# EasyEDA Pro project ProProject_GD32小车_2024-05-09.epro

# Schematic Schematic1
Create Date: 2024-04-27; Page Name: P1; Project Name: GD32小车; Schematic Name: Schematic1; Update Date: 2024-04-30; Company: 嘉立创EDA; Page Size: A4; Version: V1.0
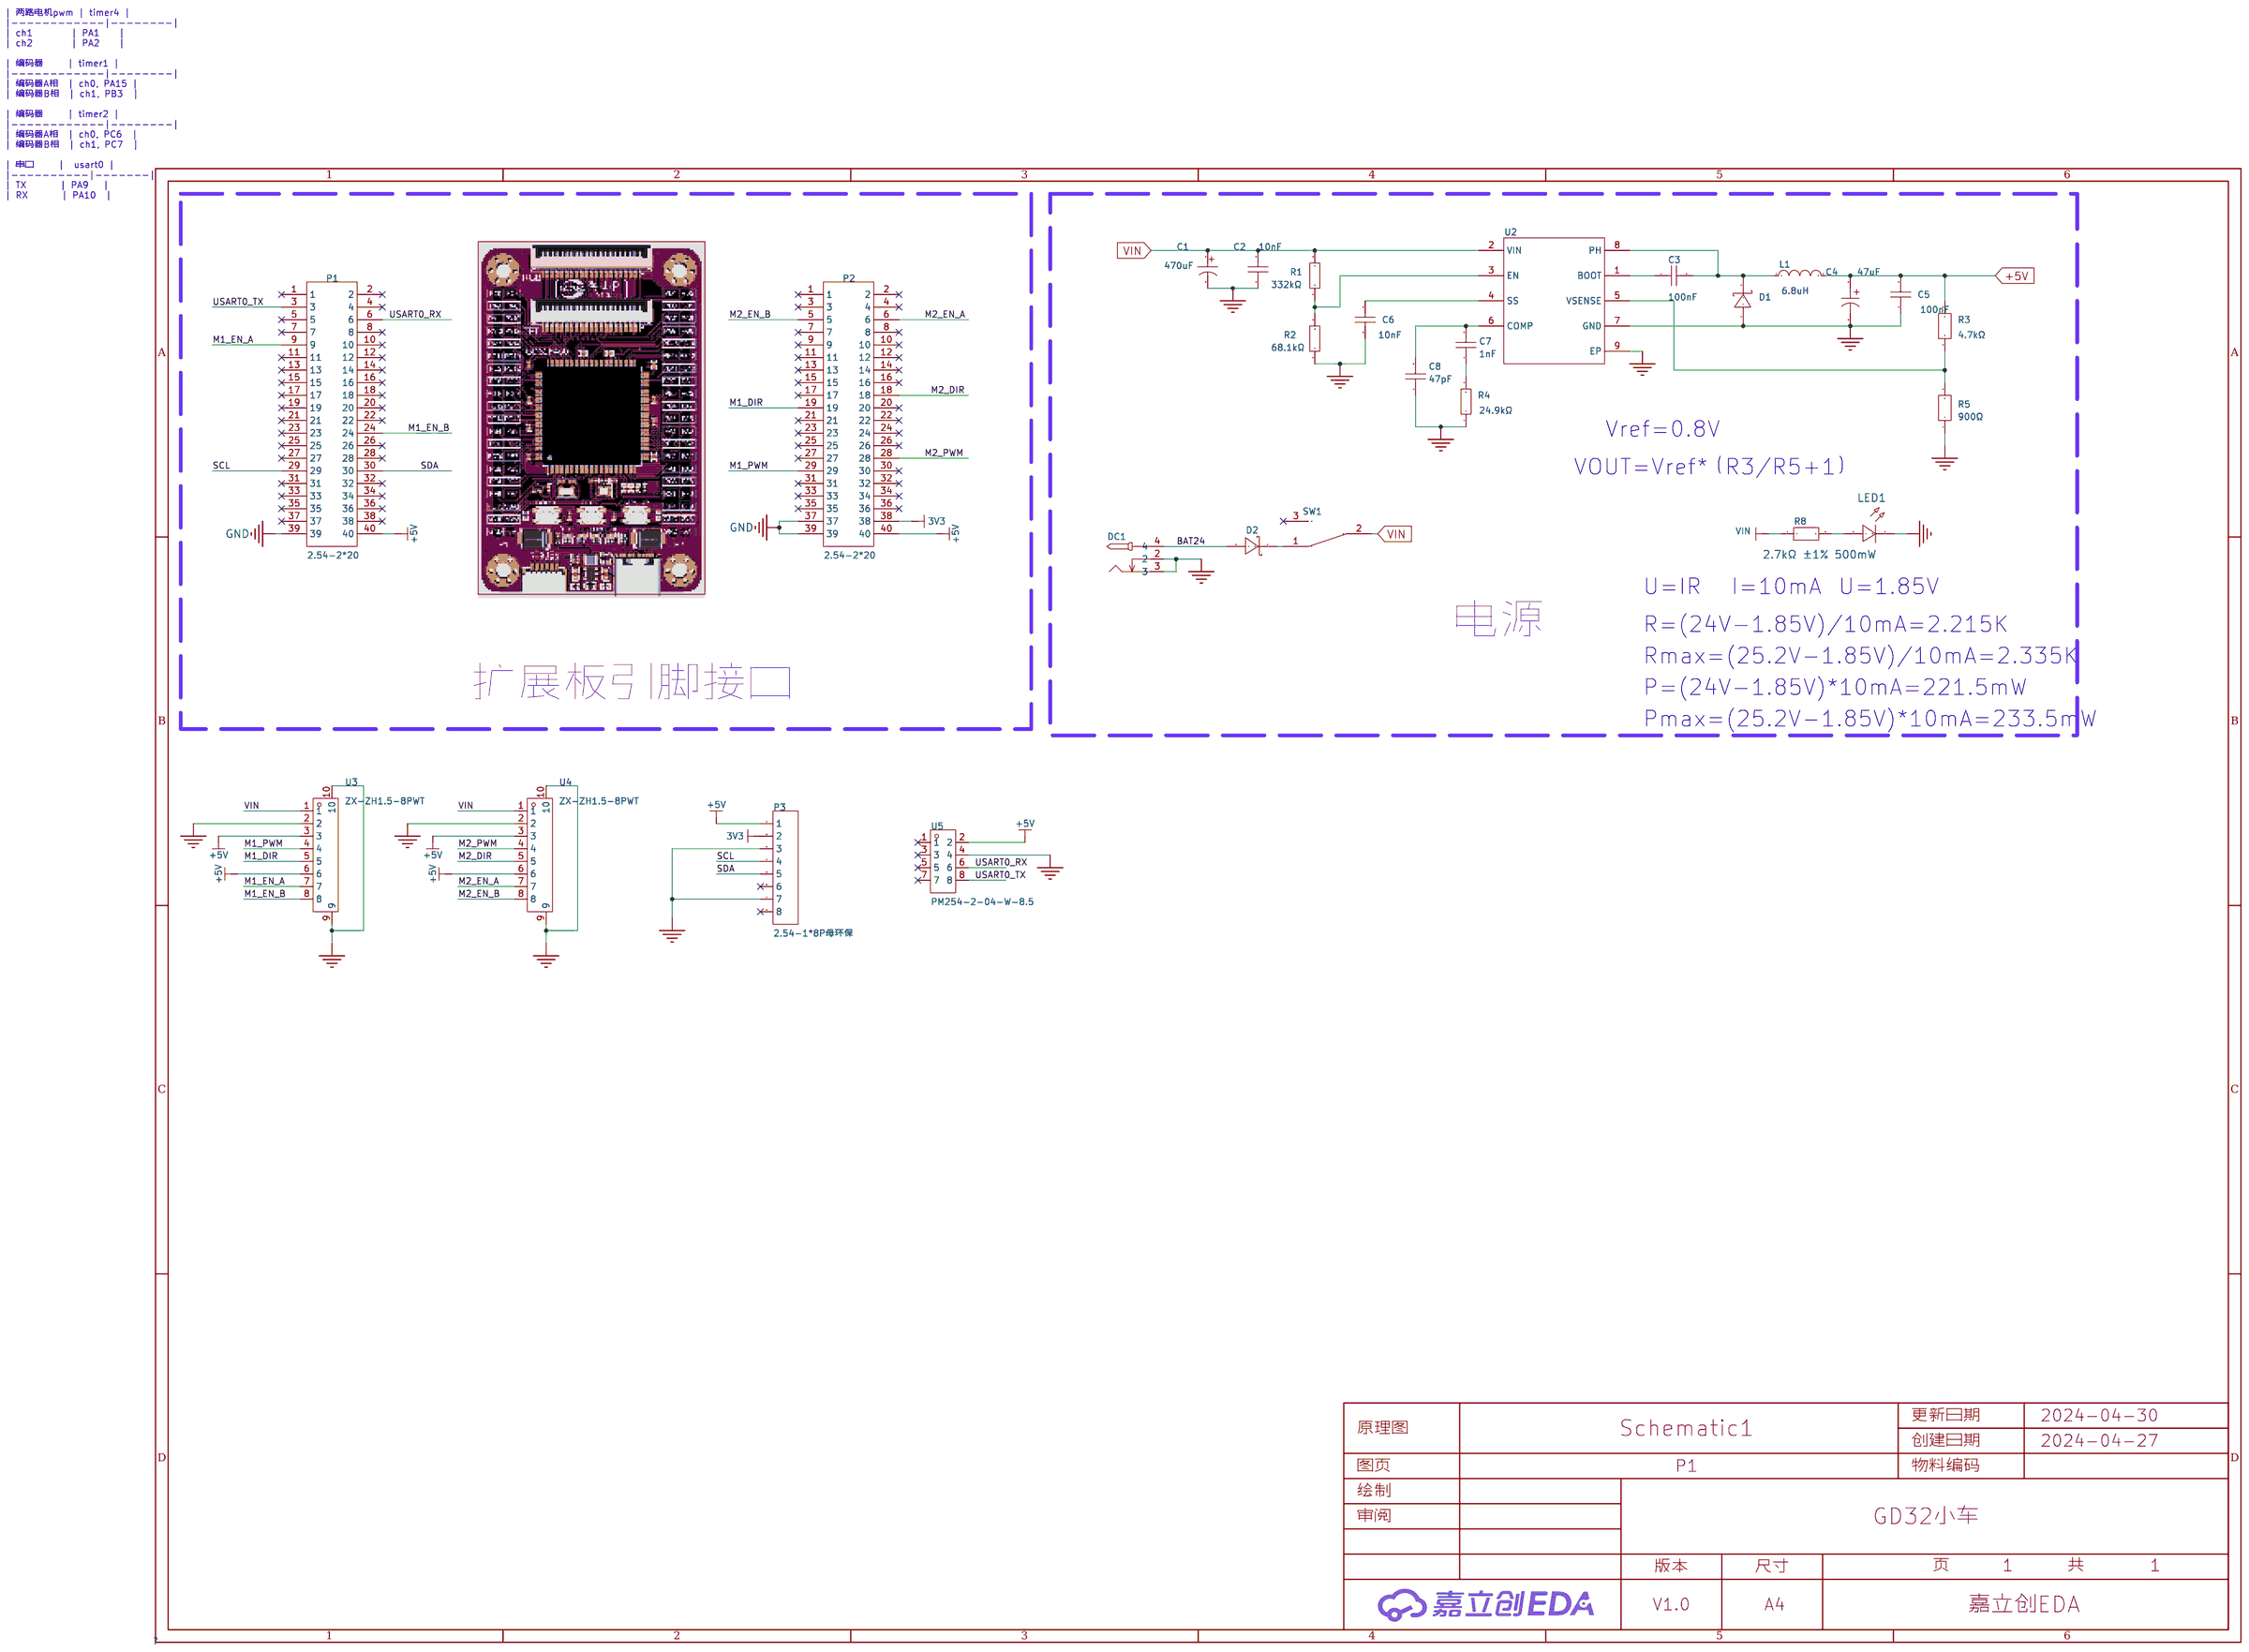
[diagram p0: schematic sheet]

## Parts
C1  470uF  [CAP-SMD_BD10.0-L10.3-W10.3-FD]
C2  10nF  [C0603]
C3  100nF  [C0603]
C4  47uF  [CAP-SMD_BD6.3-L6.6-W6.6-LS7.2-FD]
C5  100nF  [C0603]
C6  10nF  [C0603]
C7  1nF  [C0603]
C8  47pF  [C0603]
D1  B340A  [SMA_L4.3-W2.6-LS5.1-RD]
D2  SS34  [SMA_L4.4-W2.8-LS5.4-RD]
DC1  DC-005 2.0  [DC-IN-TH_DC-5520-1]
L1  6.8uH  [IND-SMD_L7.0-W6.6]
LED1  -  [LED_0805]
P1  2.54-2*20  [HDR-TH_40P-P2.54-V-F-R2-C20-S2.54]
P2  2.54-2*20  [HDR-TH_40P-P2.54-V-F-R2-C20-S2.54]
P3  2.54-1*8P母环保  [HDR-TH_8P-P2.54-V-F-1]
R1  332kΩ  [R0603]
R2  68.1kΩ  [R0603]
R3  4.7kΩ  [R0603]
R4  24.9kΩ  [R0603]
R5  900Ω  [R0603]
R8  2.7kΩ  [R1210]
SW1  EG1218  [SW-TH_EG1218]
U1  -  [梁山pi反位置封装]
U2  TPS54331DDAR  [SOIC-8_L4.9-W3.9-P1.27-LS6.0-BL-EP]
U3  ZX-ZH1.5-8PWT  [CONN-SMD_8P-P1.50_ZX-ZH1.5-8PWT]
U4  ZX-ZH1.5-8PWT  [CONN-SMD_8P-P1.50_ZX-ZH1.5-8PWT]
U5  PM254-2-04-W-8.5  [HDR-TH_8P-P2.54-H-F-R2-C4-W8.5]

## Library data of the parts
C1 = RVT1V471M1010: 容值:470uF;精度:±20%;额定电压:35V;电容体直径:10mm;电容体长度:10.2mm;纹波电流:-;等效串联电阻:-;工作寿命:2000hrs@105℃;工作温度:-55℃~+105℃;; LCSC Part Name: 470uF ±20% 35V; Supplier Part: C3350; Manufacturer: HONOR(荣誉); Supplier Footprint: SMD,D10xL10.2mm; JLCPCB Part Class: Extended Part; Datasheet: https://atta.szlcsc.com/upload/public/pdf/source/20210521/C113284_25C86AE95FB541053FE695F13EA8E7D0.pdf; Supplier: LCSC; Tolerance: ±20%; Rated Voltage: 35V; φD: 10mm; L: 10.2mm; Lifetime @ Temp: 2000hrs@105℃; Operating Temperature: -55℃~+105℃
C2 C6 = CC0603KRX7R9BB103: 容值:10nF;精度:±10%;额定电压:50V;材质(温度系数):X7R;; LCSC Part Name: 10nF ±10% 50V; Supplier Part: C100042; Manufacturer: YAGEO(国巨); Supplier Footprint: 0603; JLCPCB Part Class: Extended Part; Datasheet: https://atta.szlcsc.com/upload/public/pdf/source/20180326/C100042_E8B0111D51DE3671A0A4A59FBCEFE81C.pdf; Supplier: LCSC; Tolerance: ±10%; Voltage Rated: 50V; Temperature Coefficient: X7R
C3 C5 = 0603F104M500NT: 容值:100nF;精度:±20%;额定电压:50V;材质(温度系数):Y5V;; LCSC Part Name: 100nF ±20% 50V; Supplier Part: C42998; Manufacturer: FH(风华); Supplier Footprint: 0603; JLCPCB Part Class: Extended Part; Datasheet: https://atta.szlcsc.com/upload/public/pdf/source/20170923/C42998_1506149457343988769.pdf; Supplier: LCSC; Tolerance: ±20%; Voltage Rated: 50V; Temperature Coefficient: Y5V
C4 = RVT47UF35V67RV0039: 容值:47uF;额定电压:35V;电容体直径:-;电容体长度:-;纹波电流:-;等效串联电阻:-;工作寿命:2000hrs@105℃;; LCSC Part Name: 47uF 35V; Supplier Part: C2836440; Manufacturer: KNSCHA(科尼盛); Supplier Footprint: SMD,6.3x5.4mm; JLCPCB Part Class: Extended Part; Datasheet: https://atta.szlcsc.com/upload/public/pdf/source/20210528/C2836440_FB61BB3A7A46B9CC2A608A35871DBF0C.pdf; Supplier: LCSC; Rated Voltage: 35V; Lifetime @ Temp: 2000hrs@105℃
C7 = CC0603KRX7R9BB102: 容值:1nF;精度:±10%;额定电压:50V;材质(温度系数):X7R;; LCSC Part Name: 1nF ±10% 50V; Supplier Part: C100040; Manufacturer: YAGEO(国巨); Supplier Footprint: 0603; JLCPCB Part Class: Extended Part; Datasheet: https://atta.szlcsc.com/upload/public/pdf/source/20170420/1492670664651.pdf; Supplier: LCSC; Tolerance: ±10%; Voltage Rated: 50V; Temperature Coefficient: X7R
C8 = CC0603JRNPO9BN470: 容值:47pF;精度:±5%;额定电压:50V;材质(温度系数):NP0;; LCSC Part Name: 47pF ±5% 50V; Supplier Part: C105622; Manufacturer: YAGEO(国巨); Supplier Footprint: 0603; JLCPCB Part Class: Extended Part; Datasheet: https://atta.szlcsc.com/upload/public/pdf/source/20170425/1493115772416.pdf; Supplier: LCSC; Tolerance: ±5%; Voltage Rated: 50V; Temperature Coefficient: NP0
D1 = B340A: 正向压降(Vf):550mV@3A;直流反向耐压(Vr):40V;平均整流电流(Io):3A;; LCSC Part Name: 电压:40V 电流:3A; Supplier Part: C64982; Manufacturer: MDD; Supplier Footprint: SMA(DO-214AC); JLCPCB Part Class: Extended Part; Datasheet: https://atta.szlcsc.com/upload/public/pdf/source/20230710/CC7CF81239BC87A7012E02A96905E83C.pdf; Supplier: LCSC; Reverse Voltage (Vr): 40V; Average Rectified Current (Io): 3A; Forward Voltage (Vf@If): 550mV@3A
D2 = SS34_C266553: 直流反向耐压(Vr):40V;平均整流电流(Io):3A;正向压降(Vf):500mV@3A;; LCSC Part Name: 40V 3A 500mV@3A; Supplier Part: C266553; Manufacturer: BORN(伯恩半导体); Supplier Footprint: SMA(DO-214AC); JLCPCB Part Class: Extended Part; Datasheet: https://atta.szlcsc.com/upload/public/pdf/source/20180817/C266553_235193962D913E7AD0FE0685CBA4F6A1.pdf; Supplier: LCSC; Reverse Voltage (Vr): 40V; Average Rectified Current (Io): 3A; Forward Voltage (Vf@If): 500mV@3A
DC1 = DC-005 2.0: 连接器类型:DC电源插座;安装方式:弯插;触点内径:2mm;触点外径:6.4mm;额定电流:-;额定电压:-;工作温度范围:-;; LCSC Part Name: DC电源插座 内径:2mm 外径:6.4mm 铁材质; Supplier Part: C16214; Manufacturer: BOOMELE(博穆精密); Supplier Footprint: 插件; JLCPCB Part Class: Extended Part; Datasheet: https://atta.szlcsc.com/upload/public/pdf/source/20190827/C16214_DA59F99E888FED58D9833F5341D610B0.pdf; Supplier: LCSC; Connector Type: DC电源插座; Mounting Style: 弯插; Inside Contact Diameter: 2mm; Outside Contact Diameter: 6.4mm
L1 = TMPC0624H-6R8MG-D: 精度:±20%;直流电阻(DCR):65mΩ;电感值:6.8uH;额定电流:4A;; LCSC Part Name: 6.8uH ±20%; Supplier Part: C357230; Manufacturer: TAI-TECH(台庆); Supplier Footprint: SMD; JLCPCB Part Class: Extended Part; Datasheet: https://atta.szlcsc.com/upload/public/pdf/source/20200917/C357230_D0E636AD8F4F6E55E8FC0BE9190F699A.pdf; Supplier: LCSC; Length: 7.3mm; Tolerance: ±20%; Width: 6.6mm; DC Resistance (DCR): 65mΩ; Height: 2.2mm; Rated Current: 4A
LED1 = LED_0805-R: Supplier Footprint: 0805
P1 P2 = 2.54-2*20: 间距:2.54mm;总孔位数:40;排数:2;插孔结构:2x20P;行距:2.54mm;安装类型:直插;圆孔/方孔:方孔;额定电流:2.5A;额定电压:-;插孔方向:顶部;塑高:8.5mm;工作温度范围:-40~+105;; LCSC Part Name: 2.54mm 2x20P; Supplier Part: C2977589; Manufacturer: ZHOURI(洲日); Supplier Footprint: 直插,P=2.54mm; Datasheet: https://atta.szlcsc.com/upload/public/pdf/source/20220328/834E302BE3C038BBC5C70F5E02589B1E.pdf; Supplier: LCSC; Pitch: 2.54mm; Number of Holes: 40; Number of Rows: 2; Holes Structure: 2x20P; Row Spacing: 2.54mm; Mounting Type: 直插; Circular Hole / Square Hole: 方孔; Current Rating (Max): 2.5A; Holes Direction: 顶部; Insulation Height: 8.5mm; Operating Temperature Range: -40~+105
P3 = 2.54-1*8P母环保: 插孔结构:1x8P;间距:2.54mm;行距:-;安装类型:直插;排数:单排;总孔位数:8P;塑高:-;触头材质:-;触头镀层:-;; LCSC Part Name: 间距:2.54mm 1x8P 直插; Supplier Part: C27438; Manufacturer: BOOMELE(博穆精密); Supplier Footprint: 插件,P=2.54mm; JLCPCB Part Class: 扩展库; Datasheet: https://atta.szlcsc.com/upload/public/pdf/source/20231221/1CA800C6799ED97958773716FAA1BFFE.pdf; Supplier: LCSC; Holes Structure: 1x8P; Pitch: 2.54mm; Mounting Type: 直插; Number of Rows: 单排; Number of Holes: 8P
R1 = 0603WAF3323T5E: 精度:±1%;温度系数:±100ppm/℃;阻值:332kΩ;功率:1/10W;最大工作电压:75V;工作温度范围:-55℃~+155℃;; LCSC Part Name: 332KΩ ±1%; Supplier Part: C23139; Manufacturer: UNI-ROYAL(厚声); Supplier Footprint: 0603; JLCPCB Part Class: Extended Part; Datasheet: https://atta.szlcsc.com/upload/public/pdf/source/20170920/C23139_1505901097627982523.pdf; Supplier: LCSC; Tolerance: ±1%; Temperature Coefficient: ±100ppm/℃; Power(Watts): 1/10W; Overload Voltage (Max): 75V; Operating Temperature Range: -55℃~+155℃
R2 = 0603WAF6812T5E: 电阻类型:厚膜电阻;阻值:68.1kΩ;精度:±1%;功率:100mW;温度系数:±100ppm/℃;最大工作电压:75V;工作温度范围:-55℃~+155℃;; LCSC Part Name: 68.1kΩ ±1% 100mW; Supplier Part: C25976; Manufacturer: UNI-ROYAL(厚声); Supplier Footprint: 0603; JLCPCB Part Class: Extended Part; Datasheet: https://atta.szlcsc.com/upload/public/pdf/source/20200306/C422600_1E6D84923E4A46A82E41ADD87F860B5C.pdf; Supplier: LCSC; Type: 厚膜电阻; Tolerance: ±1%; Power(Watts): 100mW; Temperature Coefficient: ±100ppm/℃; Overload Voltage (Max): 75V; Operating Temperature Range: -55℃~+155℃
R3 = ERA3ARB472V: 最大工作电压:75V;工作温度范围:-55℃~+155℃;工作温度范围:-55℃~+155℃;精度:±0.1%;阻值:4.7kΩ;类型:薄膜电阻;功率:100mW;温度系数:±10ppm/K;温度系数:±10ppm/K;; LCSC Part Name: 4.7KΩ ±0.1% 1/10W; Supplier Part: C509091; Manufacturer: PANASONIC(松下); Supplier Footprint: 0603; JLCPCB Part Class: Extended Part; Datasheet: https://atta.szlcsc.com/upload/public/pdf/source/20200407/C509091_BA1790FF67ECCE5D526E030A767C13DB.pdf; Supplier: LCSC; Overload Voltage (Max): 75V; Operating Temperature Range: -55℃~+155℃; Tolerance: ±0.1%; Type: 薄膜电阻; Power(Watts): 100mW; Temperature Coefficient: ±10ppm/K
R4 = 0603WAF2492T5E: 精度:±1%;温度系数:±100ppm/℃;阻值:24.9kΩ;功率:1/10W;最大工作电压:75V;工作温度范围:-55℃~+155℃;; LCSC Part Name: 24.9KΩ ±1%; Supplier Part: C25962; Manufacturer: UNI-ROYAL(厚声); Supplier Footprint: 0603; JLCPCB Part Class: Extended Part; Datasheet: https://atta.szlcsc.com/upload/public/pdf/source/20170920/C25962_1505895130816980962.pdf; Supplier: LCSC; Tolerance: ±1%; Temperature Coefficient: ±100ppm/℃; Power(Watts): 1/10W; Overload Voltage (Max): 75V; Operating Temperature Range: -55℃~+155℃
R5 = 0603WAF9000T5E: 电阻类型:厚膜电阻;阻值:900Ω;精度:±1%;功率:100mW;温度系数:±100ppm/℃;最大工作电压:75V;工作温度范围:-55℃~+155℃;; LCSC Part Name: 900Ω ±1% 100mW; Supplier Part: C422898; Manufacturer: UNI-ROYAL(厚声); Supplier Footprint: 0603; JLCPCB Part Class: Extended Part; Datasheet: https://atta.szlcsc.com/upload/public/pdf/source/20200306/C422600_1E6D84923E4A46A82E41ADD87F860B5C.pdf; Supplier: LCSC; Type: 厚膜电阻; Tolerance: ±1%; Power(Watts): 100mW; Temperature Coefficient: ±100ppm/℃; Overload Voltage (Max): 75V; Operating Temperature Range: -55℃~+155℃
R8 = 1210W2F2701T5E: 电阻类型:厚膜电阻;阻值:2.7kΩ;精度:±1%;功率:500mW;温度系数:±100ppm/℃;最大工作电压:200V;工作温度范围:-55℃~+155℃;; LCSC Part Name: 2.7kΩ ±1% 500mW; Supplier Part: C422342; Manufacturer: UNI-ROYAL(厚声); Supplier Footprint: 1210; JLCPCB Part Class: Extended Part; Datasheet: https://atta.szlcsc.com/upload/public/pdf/source/20200306/C422600_1E6D84923E4A46A82E41ADD87F860B5C.pdf; Supplier: LCSC; Type: 厚膜电阻; Tolerance: ±1%; Power(Watts): 500mW; Temperature Coefficient: ±100ppm/℃; Overload Voltage (Max): 200V; Operating Temperature Range: -55℃~+155℃
SW1 = EG1218: 额定电流(DC):200mA;额定电压(DC):30V;额定电流(AC):-;额定电压(AC):-;电路结构:单刀双掷;安装方式:直插;机械寿命:-;滑钮形状:矩形柱状;引脚样式:PC引脚;工作温度:-20℃~+70℃;开关高度:7.4mm;; Supplier Part: C273394; Manufacturer: E-Switch; Supplier Footprint: 插件; JLCPCB Part Class: Extended Part; Datasheet: https://atta.szlcsc.com/upload/public/pdf/source/20180927/C273394_90E3D6196109E23F55625D9195114BDA.pdf; Supplier: LCSC; Current Rating (DC): 200mA; Voltage Rating (DC): 30V; Circuit: 单刀双掷; Mounting Style: 直插; Actuator Style: 矩形柱状; Pin Style: PC引脚; Operating Temperature: -20℃~+70℃; Switch Height: 7.4mm
U1 = 梁山pi反转接位置模型: Sram芯片排针向上，位置io全显示
U2 = TPS54331DDAR: 功能类型:降压型;输出类型:可调;输入电压:3.5V~28V;输出电压:800mV~25V;输出电流(最大值):3A;; Supplier Part: C90761; Manufacturer: TI(德州仪器); Supplier Footprint: SOIC-8-EP; JLCPCB Part Class: Extended Part; Datasheet: https://www.ti.com/cn/lit/gpn/tps54331; Supplier: LCSC; Function: 降压型; Synchronous Rectification: 否; Number of Outputs: 1; Topology: 降压式; Input Voltage: 3.5V~28V; Output Current (Max): 3A; Switching Frequency: 570kHz; Output Type: 可调; Output Voltage: 800mV~25V; Operating Temperature: -40℃~+150℃@(TJ); Switch tube (built-in/external): 内置
U3 U4 = ZX-ZH1.5-8PWT: 插针结构:1x8P;间距:1.5mm;安装方式:卧贴;参考系列:ZH;总PIN数:8P;排数:1;每排PIN数:8;行距:-;额定电流:1A;触头材质:黄铜;触头镀层:锡;工作温度范围:-25℃~+85℃;; LCSC Part Name: 1x8P 间距:1.5mm 卧贴 系列:ZH; Supplier Part: C19272411; Manufacturer: Megastar(兆星); Supplier Footprint: SMD,P=1.5mm,卧贴; Datasheet: https://atta.szlcsc.com/upload/public/pdf/source/20231201/C5A824B953C40A6060EBF5A541254C86.pdf; Supplier: LCSC; Pins Structure: 1x8P; Pitch: 1.5mm; Mounting Style: 卧贴; Reference Series: ZH; Number of Pins: 8P; Number of Rows: 1; Number of PINs Per Row: 8; Current Rating (Max): 1A; Contact Material: 黄铜; Contact Plating: 锡; Operating Temperature Range: -25℃~+85℃
U5 = PM254-2-04-W-8.5: 插孔结构:2x4P;间距:2.54mm;行距:2.54mm;圆孔/方孔:方孔;安装类型:弯插;排数:双排;总孔位数:8P;额定电流:3A;额定电压:-;插孔方向:侧面;塑高:8.5mm;触头材质:铜合金;工作温度范围:-40℃~+105℃;焊接温度(最大值):260℃@5S;; LCSC Part Name: 2x4P 间距:2.54mm 弯插; Supplier Part: C2897424; Manufacturer: HCTL(华灿天禄); Supplier Footprint: 弯插,P=2.54mm; JLCPCB Part Class: 扩展库; Datasheet: https://atta.szlcsc.com/upload/public/pdf/source/20230609/283C0D22EF4E6FFE03D5A855876981ED.pdf; Supplier: LCSC; Holes Structure: 2x4P; Pitch: 2.54mm; Row Spacing: 2.54mm; Circular Hole / Square Hole: 方孔; Mounting Type: 弯插; Number of Rows: 双排; Number of Holes: 8P; Current Rating (Max): 3A; Holes Direction: 侧面; Insulation Height: 8.5mm; Contact Material: 铜合金; Operating Temperature Range: -40℃~+105℃; Soldering Temperature(Max): 260℃@5S

## Nets
3V3: P2.38 P3.2
+5V: C4.1 C5.2 L1.2 P1.40 P2.40 P3.1 R3.2 U3.3 U3.6 U4.3 U4.6 U5.2
GND: C1.2 C2.1 C4.2 C5.1 C6.1 C8.1 D1.2(A) DC1.2 DC1.3 LED1.1(C) P1.39 P2.37 P2.39 P3.3 P3.7 R2.1 R4.1 R5.1 U2.7(GND) U2.9(EP) U3.2 U3.9 U3.10 U4.2 U4.9 U4.10 U5.4
VIN: C1.1 C2.2 R1.2 R8.1 SW1.2 U2.2(VIN) U3.1 U4.1
BAT24: D2.2(A) DC1.4
M1_DIR: P2.19 U3.5
M1_EN_A: P1.9 U3.7
M1_EN_B: P1.24 U3.8
M1_PWM: P2.29 U3.4
M2_DIR: P2.18 U4.5
M2_EN_A: P2.6 U4.7
M2_EN_B: P2.5 U4.8
M2_PWM: P2.28 U4.4
SCL: P1.29 P3.4
SDA: P1.30 P3.5
USART0_RX: P1.6 U5.6
USART0_TX: P1.3 U5.8
$1N3054: D2.1(C) SW1.1
$1N3055: C6.2 U2.4(SS)
$1N3056: C3.1 U2.1(BOOT)
$1N3058: C3.2 D1.1(K) L1.1 U2.8(PH)
$1N3060: C7.1 R4.2
$1N3061: C7.2 C8.2 U2.6(COMP)
$1N3063: R1.1 R2.2 U2.3(EN)
$1N3066: R3.1 R5.2 U2.5(VSENSE)
$1N3070: LED1.2(A) R8.2

Not connected (* = marked no-connect by the designer): P1 1* 2* 4* 5* 7* 8* 10* 11* 12* 13* 14* 15* 16* 17* 18* 19* 20* 21* 22* 23* 25* 26* 27* 28* 31* 32* 33* 34* 35* 36* 37* 38*; P2 1* 2* 3* 4* 7* 8* 9* 10* 11* 12* 13* 14* 15* 16* 17* 20* 21* 22* 23* 24* 25* 26* 27* 30* 31* 32* 33* 34* 35* 36*; P3 6* 8*; SW1 3*; U5 1* 3* 5* 7*

## Notes on the sheet
- | 两路电机pwm | timer4 |
  |------------|--------|
  | ch1        | PA1    |
  | ch2        | PA2    |
  | 编码器     | timer1 |
  |------------|--------|
  | 编码器A相  | ch0, PA15 |
  | 编码器B相  | ch1, PB3  |
  | 编码器     | timer2 |
  |------------|--------|
  | 编码器A相  | ch0, PC6  |
  | 编码器B相  | ch1, PC7  |
  | 串口     |  usart0 |
  |----------|-------|
  | TX       | PA9   |
  | RX       | PA10  |
- Vref=0.8V
- VOUT=Vref*（R3/R5+1）
- U=IR
- I=10mA
- U=1.85V
- 电源
- R=(24V-1.85V)/10mA=2.215K
- Rmax=(25.2V-1.85V)/10mA=2.335K
- P=(24V-1.85V)*10mA=221.5mW
- 扩展板引脚接口
- Pmax=(25.2V-1.85V)*10mA=233.5mW

# Board PCB1
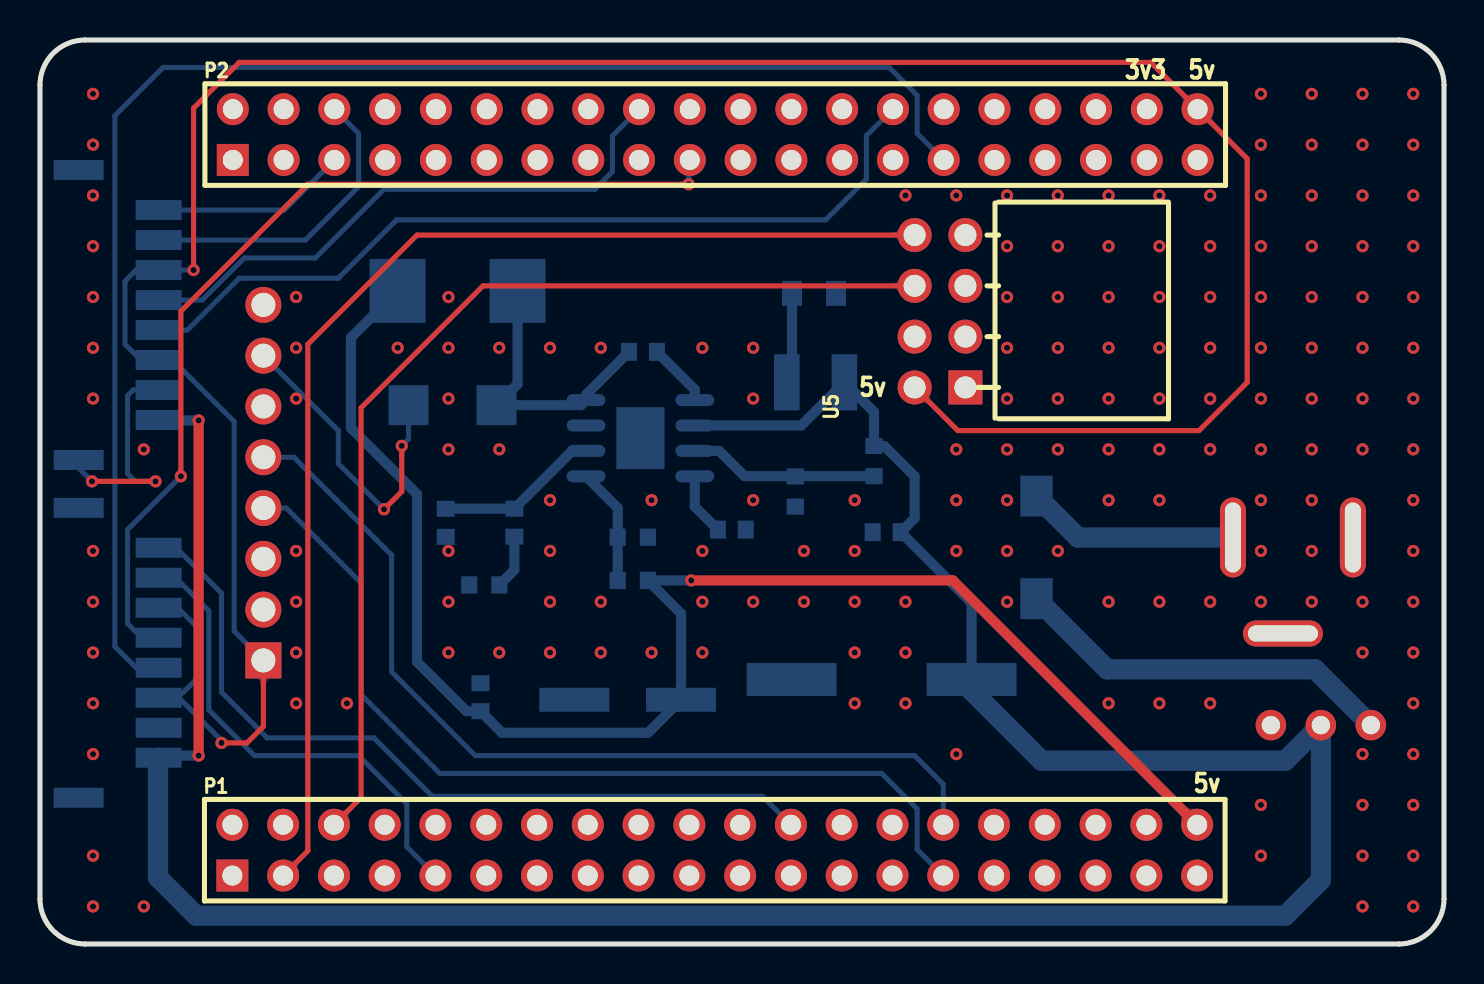
[diagram p1: board, top side]
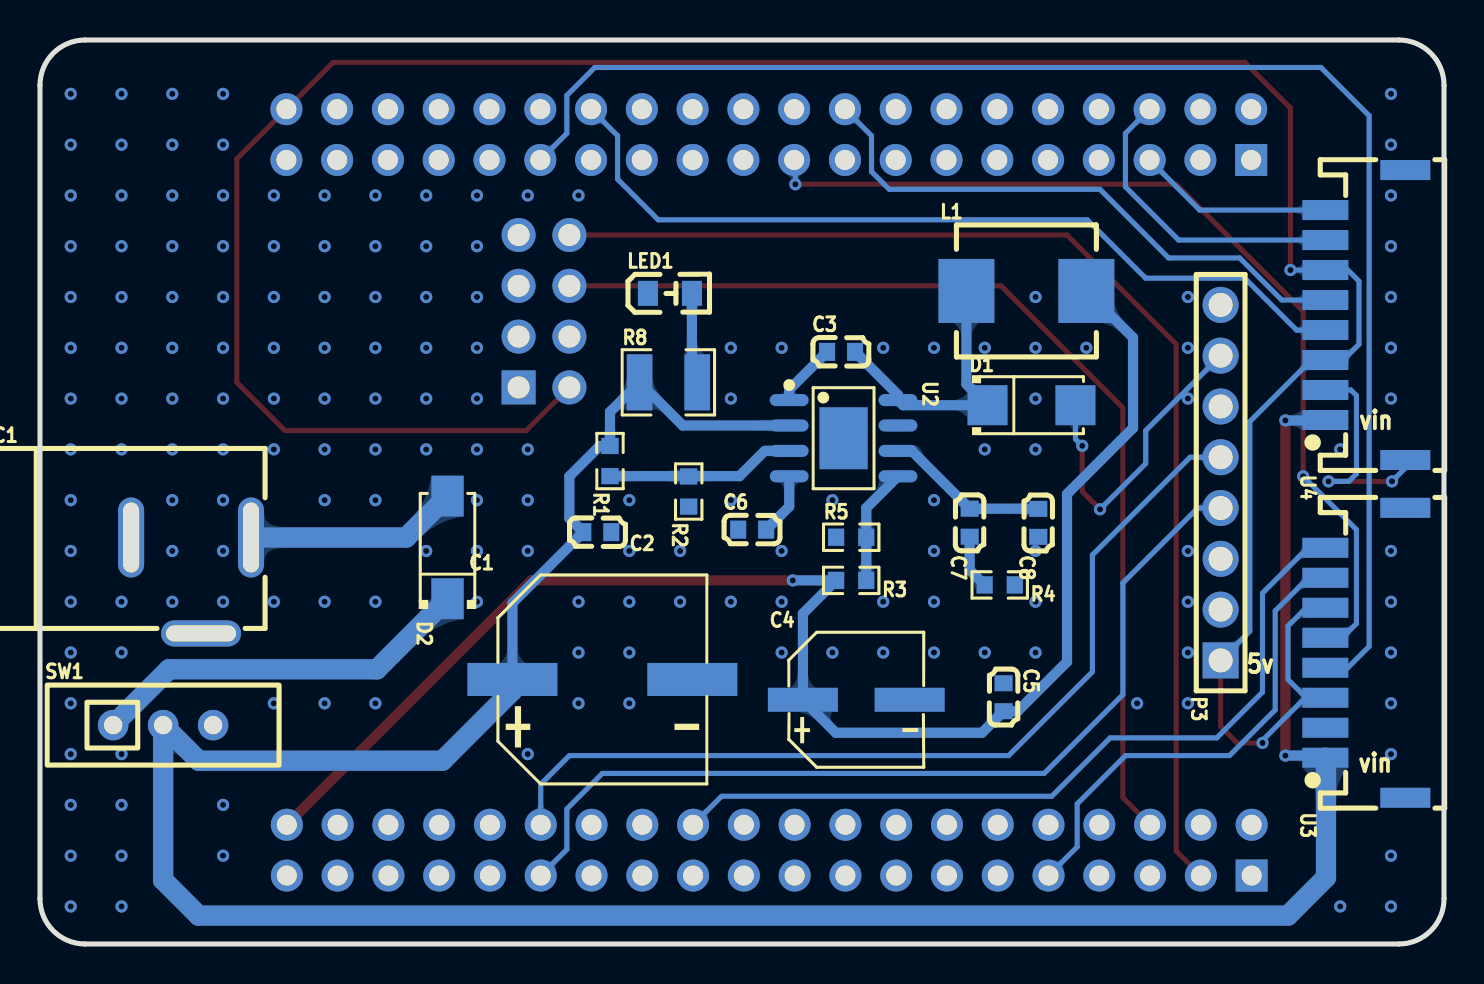
[diagram p2: board, bottom side, seen from below]

Outline 70.23 x 45.21 mm; copper layers: Top Layer, Bottom Layer. Coordinates in mm from the lower left corner of the outline.
Outline path: 0,42.95 0,2.26 arc(0.66,0.66) 2.26,0 67.97,0 arc(69.57,0.66) 70.23,2.26 70.23,42.95 arc(69.57,44.55) 67.97,45.21 2.26,45.21 arc(0.66,44.55) 0,42.95
Stack: Top Layer 0.035mm / Dielectric1 1.51mm FR4 er 4.5 / Bottom Layer 0.035mm

## Design rules (mm)
template: JLCPCB Capability(Multiple Layers Board)
spacing copperThickness1oz (default): track to track 0.102, other pairs 0.152 to 0.3
spacing copperThickness2oz: track to track 0.203, other pairs 0.152 to 0.3
spacing copperThicknessInner0.5oz: track to track 0.089, other pairs 0.152 to 0.3
track width copperThickness1oz (default): min 0.102, default 0.254, max 2.54
track width copperThickness2oz: min 0.203, default 0.254, max 2.54
track width copperThickness0.5oz: min 0.089, default 0.254, max 2.54
differential pair differentialPair (default): width min 0.127, default 0.254, max 2.54; gap min 0.152, default 0.152
via viaSize (default): diameter min 0.3, default 0.61, max 10; hole min 0.2, default 0.305, max 6.3

## Placement (name value [footprint] x y rotation side)
C1  470uF  [CAP-SMD_BD10.0-L10.3-W10.3-FD]  42.1 13.23 180 bottom
C2  10nF  [C0603]  42.35 20.6 0 bottom
C3  100nF  [C0603]  30.16 29.61 180 bottom
C4  47uF  [CAP-SMD_BD6.3-L6.6-W6.6-LS7.2-FD]  29.4 12.22 180 bottom
C5  100nF  [C0603]  22.03 12.34 270 bottom
C6  10nF  [C0603]  34.61 20.72 180 bottom
C7  1nF  [C0603]  23.73 21.07 90 bottom
C8  47pF  [C0603]  20.3 21.06 90 bottom
D1  B340A  [SMA_L4.3-W2.6-LS5.1-RD]  20.64 26.95 180 bottom
D2  SS34  [SMA_L4.4-W2.8-LS5.4-RD]  49.85 19.84 90 bottom
DC1  DC-005 2.0  [DC-IN-TH_DC-5520-1]  62.67 17.93 180 bottom
L1  6.8uH  [IND-SMD_L7.0-W6.6]  20.89 32.66 180 bottom
LED1  -  [LED_0805]  38.67 32.54 180 bottom
P1  2.54-2*20  [HDR-TH_40P-P2.54-V-F-R2-C20-S2.54]  33.75 4.69 0 top
P2  2.54-2*20  [HDR-TH_40P-P2.54-V-F-R2-C20-S2.54]  33.78 40.48 0 top
P3  2.54-1*8P母环保  [HDR-TH_8P-P2.54-V-F-1]  11.17 23.07 90 bottom
R1  332kΩ  [R0603]  41.72 24.15 90 bottom
R2  68.1kΩ  [R0603]  37.78 22.63 90 bottom
R3  4.7kΩ  [R0603]  29.65 18.18 0 bottom
R4  24.9kΩ  [R0603]  22.23 17.96 0 bottom
R5  900Ω  [R0603]  29.65 20.34 180 bottom
R8  2.7kΩ  [R1210]  38.8 28.09 180 bottom
SW1  EG1218  [SW-TH_EG1218]  64.07 10.95 180 bottom
U2  TPS54331DDAR  [SOIC-8_L4.9-W3.9-P1.27-LS6.0-BL-EP]  30.03 25.3 270 bottom
U3  ZX-ZH1.5-8PWT  [CONN-SMD_8P-P1.50_ZX-ZH1.5-8PWT]  3.94 14.56 90 bottom
U4  ZX-ZH1.5-8PWT  [CONN-SMD_8P-P1.50_ZX-ZH1.5-8PWT]  3.94 31.46 90 bottom
U5  PM254-2-04-W-8.5  [HDR-TH_8P-P2.54-H-F-R2-C4-W8.5]  45.02 31.65 90 top

## Footprints (pads in the part's own frame, mm; a bottom-side part is the same pattern mirrored in y, then rotated)
C0603
  rect 0.8x0.9 smd: 1(-0.7,0) 2(0.7,0)
CAP-SMD_BD6.3-L6.6-W6.6-LS7.2-FD
  rect 3.5x1.2 smd: 1(-2.67,0) 2(2.67,0)
CAP-SMD_BD10.0-L10.3-W10.3-FD
  rect 4.5x1.65 smd: 1(-4.5,0) 2(4.5,0)
CONN-SMD_8P-P1.50_ZX-ZH1.5-8PWT
  rect 1x2.3 smd: 1(-5.25,2) 2(-3.75,2) 3(-2.25,2) 4(-0.75,2) 5(0.75,2) 6(2.25,2) 7(3.75,2) 8(5.25,2)
  rect 1x2.5 smd: 9(7.25,-2) 10(-7.25,-2)
DC-IN-TH_DC-5520-1
  oval 4x1.3 hole 3.5x0.8: 2(0.5,-2.4)
  oval 1.3x4 hole 0.8x3.5: 3(-3,2.4) 4(3,2.4)
HDR-TH_8P-P2.54-H-F-R2-C4-W8.5
  rect 1.7x1.7 hole 1.1: 1(-3.81,-1.27)
  round 1.7 hole 1.1: 2(-3.81,1.27) 3(-1.27,-1.27) 4(-1.27,1.27) 5(1.27,-1.27) 6(1.27,1.27) 7(3.81,-1.27) 8(3.81,1.27)
HDR-TH_8P-P2.54-V-F-1
  rect 1.8x1.8 hole 1.2: 1(-8.89,0)
  round 1.8 hole 1.2: 2(-6.35,0) 3(-3.81,0) 4(-1.27,0) 5(1.27,0) 6(3.81,0) 7(6.35,0) 8(8.89,0)
HDR-TH_40P-P2.54-V-F-R2-C20-S2.54
  rect 1.6x1.6 hole 1: 1(-24.13,-1.27)
  round 1.6 hole 1: 2(-24.13,1.27) 3(-21.59,-1.27) 4(-21.59,1.27) 5(-19.05,-1.27) 6(-19.05,1.27) 7(-16.51,-1.27) 8(-16.51,1.27) 9(-13.97,-1.27) 10(-13.97,1.27) 11(-11.43,-1.27) 12(-11.43,1.27) 13(-8.89,-1.27) 14(-8.89,1.27) 15(-6.35,-1.27) 16(-6.35,1.27) 17(-3.81,-1.27) 18(-3.81,1.27) 19(-1.27,-1.27) 20(-1.27,1.27) 21(1.27,-1.27) 22(1.27,1.27) 23(3.81,-1.27) 24(3.81,1.27) 25(6.35,-1.27) 26(6.35,1.27) 27(8.89,-1.27) 28(8.89,1.27) 29(11.43,-1.27) 30(11.43,1.27) 31(13.97,-1.27) 32(13.97,1.27) 33(16.51,-1.27) 34(16.51,1.27) 35(19.05,-1.27) 36(19.05,1.27) 37(21.59,-1.27) 38(21.59,1.27) 39(24.13,-1.27) 40(24.13,1.27)
IND-SMD_L7.0-W6.6
  rect 2.8x3.2 smd: 1(-3,0) 2(3,0)
LED_0805
  rect 1x1.25 smd: 1(-1.15,0.005) 2(1.05,0.005)
R0603
  rect 0.806x0.864 smd: 1(-0.753,0) 2(0.753,0)
R1210
  rect 1.282x2.808 smd: 1(-1.441,0) 2(1.441,0)
SMA_L4.3-W2.6-LS5.1-RD
  rect 2x2 smd: 1(-2.2,0) 2(2.2,0)
SMA_L4.4-W2.8-LS5.4-RD
  rect 2.046x1.62 smd: 1(-2.566,0) 2(2.566,0)
SOIC-8_L4.9-W3.9-P1.27-LS6.0-BL-EP
  oval 0.602x1.941 smd: 1(-1.905,-2.72) 2(-0.635,-2.72) 3(0.635,-2.72) 4(1.905,-2.72) 5(1.905,2.72) 6(0.635,2.72) 7(-0.635,2.72) 8(-1.905,2.72)
  rect 3.098x2.41 smd: 9(0,0)
SW-TH_EG1218
  round 1.524 hole 0.914: 1(-2.5,0) 2(0,0) 3(2.5,0)

## Nets
As in the schematic.

Pads without a net: P1 1 2 4 5 7 8 10 11 12 13 14 15 16 17 18 19 20 21 22 23 25 26 27 28 31 32 33 34 35 36 37 38; P2 1 2 3 4 7 8 9 10 11 12 13 14 15 16 17 20 21 22 23 24 25 26 27 30 31 32 33 34 35 36; P3 6 8; SW1 3; U5 1 3 5 7

## Via types
v1: diameter 0.61, hole 0.305, Top Layer to Bottom Layer, 177 vias

## Routing (per net, layer and track width the routed paths; a pad name or vN(x,y) marks a point on that pad's centre or on a via; arc(x,y) is an arc through that point)
+5V: length 212.4
  Top Layer w0.254: v1(7.68,33.71) 7.68,41.81 9.97,44.09 55.57,44.09 P2.40 60.39,39.27 60.39,28.09 57.97,25.68 45.91,25.68 U5.2 ; P3.1 11.17,10.88 10.35,10.06 v1(9.08,10.06)
  Top Layer w0.508: v1(32.57,18.18) 45.66,18.18 P1.40
  Bottom Layer w0.254: U3.6 6.89,16.81 7.81,15.9 7.81,13.23 6.92,12.34 ; v1(9.08,10.06) 9.08,10.18 6.92,12.34 ; P3.1 9.71,15.64 9.71,26.13 6.64,29.21 U4.3 5.04,29.21 4.25,30 4.25,33.15 4.81,33.71 U4.6 v1(7.68,33.71) ; 6.92,12.34 6.89,12.31 U3.3 5.96,12.34 6.92,12.34
  Bottom Layer w0.508: v1(32.57,18.18) R3.2 32.07,16.52 C4.1 30.42,10.56 23.11,10.56 C5.2 21.33,11.64 18.86,14.11 18.86,22.5 15.56,25.8 15.56,30.33 L1.2
GND: length 27.6
  Top Layer w0.254: v1(5.78,23.14) v1(2.6,23.14) ; v1(17.21,21.74) 18.1,22.63 v1(18.1,24.92)
  Bottom Layer w0.254: v1(18.1,24.92) 18.44,25.26 18.44,26.95 ; v1(5.78,23.14) 4.76,23.14 4.38,23.52 4.38,27.43 4.66,27.71 U4.2 ; v1(2.6,23.14) 1.94,23.8 U4.10 ; v1(17.21,21.74) 14.92,24.03 14.92,25.68 P3.7
  vias: v1(2.65,42.52) v1(2.65,39.98) v1(2.65,37.44) v1(2.65,34.9) v1(2.65,32.36) v1(2.65,29.82) v1(2.65,27.28) v1(2.65,19.66) v1(2.65,17.12) v1(2.65,14.58) v1(2.65,12.04) v1(2.65,9.5) v1(2.65,4.42) v1(2.65,1.88) v1(5.19,24.74) v1(5.19,1.88) v1(12.81,32.36) v1(12.81,29.82) v1(12.81,27.28) v1(12.81,19.66) v1(12.81,17.12) v1(12.81,14.58) v1(12.81,12.04) v1(15.35,12.04) v1(17.89,29.82) v1(20.43,32.36) v1(20.43,29.82) v1(20.43,27.28) v1(20.43,24.74) v1(20.43,19.66) v1(20.43,17.12) v1(20.43,14.58) v1(22.97,29.82) v1(22.97,24.74) v1(22.97,14.58) v1(25.51,29.82) v1(25.51,22.2) v1(25.51,19.66) v1(25.51,17.12) v1(25.51,14.58) v1(28.05,29.82) v1(28.05,17.12) v1(28.05,14.58) v1(30.59,22.2) v1(30.59,14.58) v1(33.13,29.82) v1(33.13,19.66) v1(33.13,17.12) v1(33.13,14.58) v1(35.67,29.82) v1(35.67,27.28) v1(35.67,22.2) v1(35.67,17.12) v1(38.21,19.66) v1(38.21,17.12) v1(40.75,22.2) v1(40.75,19.66) v1(40.75,17.12) v1(40.75,14.58) v1(40.75,12.04) v1(43.29,37.44) v1(43.29,17.12) v1(43.29,14.58) v1(43.29,12.04) v1(45.83,37.44) v1(45.83,24.74) v1(45.83,22.2) v1(45.83,19.66) v1(45.83,9.5) v1(48.37,37.44) v1(48.37,34.9) v1(48.37,32.36) v1(48.37,29.82) v1(48.37,27.28) v1(48.37,24.74) v1(48.37,22.2) v1(48.37,19.66) v1(48.37,17.12) v1(50.91,37.44) v1(50.91,34.9) v1(50.91,32.36) v1(50.91,29.82) v1(50.91,27.28) v1(50.91,24.74) v1(50.91,19.66) v1(53.45,37.44) v1(53.45,34.9) v1(53.45,32.36) v1(53.45,29.82) v1(53.45,27.28) v1(53.45,24.74) v1(53.45,22.2) v1(53.45,17.12) v1(53.45,12.04) v1(55.99,37.44) v1(55.99,34.9) v1(55.99,32.36) v1(55.99,29.82) v1(55.99,27.28) v1(55.99,24.74) v1(55.99,22.2) v1(55.99,17.12) v1(55.99,12.04) v1(58.53,37.44) v1(58.53,34.9) v1(58.53,32.36) v1(58.53,29.82) v1(58.53,27.28) v1(58.53,24.74) v1(58.53,17.12) v1(58.53,12.04) v1(61.07,42.52) v1(61.07,39.98) v1(61.07,37.44) v1(61.07,34.9) v1(61.07,32.36) v1(61.07,29.82) v1(61.07,27.28) v1(61.07,24.74) v1(61.07,22.2) v1(61.07,19.66) v1(61.07,17.12) v1(61.07,6.96) v1(61.07,4.42) v1(63.61,42.52) v1(63.61,39.98) v1(63.61,37.44) v1(63.61,34.9) v1(63.61,32.36) v1(63.61,29.82) v1(63.61,27.28) v1(63.61,24.74) v1(63.61,22.2) v1(63.61,19.66) v1(63.61,17.12) v1(66.15,42.52) v1(66.15,39.98) v1(66.15,37.44) v1(66.15,34.9) v1(66.15,32.36) v1(66.15,29.82) v1(66.15,27.28) v1(66.15,24.74) v1(66.15,17.12) v1(66.15,14.58) v1(66.15,9.5) v1(66.15,6.96) v1(66.15,4.42) v1(66.15,1.88) v1(68.69,42.52) v1(68.69,39.98) v1(68.69,37.44) v1(68.69,34.9) v1(68.69,32.36) v1(68.69,29.82) v1(68.69,27.28) v1(68.69,24.74) v1(68.69,22.2) v1(68.69,19.66) v1(68.69,17.12) v1(68.69,14.58) v1(68.69,12.04) v1(68.69,9.5) v1(68.69,6.96) v1(68.69,4.42) v1(68.69,1.88)
VIN: length 141.2
  Top Layer w0.508: v1(7.94,9.42) v1(7.94,26.19)
  Bottom Layer w0.508: U3.1 6.04,9.42 v1(7.94,9.42) ; C1.1 46.6,17.05 C2.2 43.75,21.29 43.75,23.39 42.23,24.91 R1.2 41.72,26.61 R8.1 38.08,25.93 U2.2 ; U4.1 5.96,26.19 v1(7.94,26.19)
  Bottom Layer w1.016: C1.1 46.6,12.67 50.1,9.17 62.29,9.17 SW1.2 64.07,3.2 62.29,1.42 7.81,1.42 5.9,3.33 5.9,9.28 U3.1
BAT24: length 10.7
  Bottom Layer w1.016: 59.67,20.33 51.92,20.33 D2.2
M1_DIR: length 47.8
  Top Layer w0.254: v1(7.05,23.39) 7.05,31.65 13.4,38 v1(32.45,38)
  Bottom Layer w0.254: v1(7.05,23.39) 4.38,20.72 4.38,16.03 5.09,15.31 U3.5 ; P2.19 32.45,39.15 v1(32.45,38)
M1_EN_A: length 24.2
  Bottom Layer w0.254: U3.7 6.79,18.31 8.44,16.66 8.44,11.71 10.73,9.42 15.94,9.42 18.35,7.01 18.35,4.86 P1.9
M1_EN_B: length 40.3
  Bottom Layer w0.254: U3.8 6.81,19.81 9.08,17.55 9.08,12.6 11.37,10.31 16.7,10.31 19.62,7.39 36.14,7.39 P1.24
M1_PWM: length 74.7
  Bottom Layer w0.254: P2.29 43.88,40.54 43.88,42.44 42.48,43.84 6.16,43.84 3.75,41.43 3.75,14.88 4.81,13.81 U3.4
M2_DIR: length 29
  Bottom Layer w0.254: U4.5 8.11,32.21 10.22,34.31 13.78,34.31 17.21,37.74 27.75,37.74 28.64,38.63 28.64,40.42 P2.18
M2_EN_A: length 15.5
  Bottom Layer w0.254: U4.7 13.27,35.21 15.94,37.87 15.94,40.54 P2.6
M2_EN_B: length 9.8
  Bottom Layer w0.254: P2.5 12.22,36.71 U4.8
M2_PWM: length 42.6
  Bottom Layer w0.254: U4.4 7.38,30.71 9.97,33.3 14.92,33.3 17.84,36.22 39.3,36.22 41.34,38.25 41.34,40.42 P2.28
SCL: length 46.1
  Bottom Layer w0.254: P1.29 43.88,4.73 43.88,6.75 42.1,8.53 20,8.53 16.06,12.47 16.06,18.06 12.32,21.8 P3.4
SDA: length 46.2
  Bottom Layer w0.254: P1.30 45.18,7.99 43.75,9.42 21.78,9.42 17.59,13.61 17.59,19.45 12.7,24.34 P3.5
USART0_RX: length 51.6
  Top Layer w0.254: P1.6 16.06,7.32 16.06,26.82 22.16,32.92 43.75,32.92
USART0_TX: length 59.7
  Top Layer w0.254: U5.8 18.86,35.46 13.4,30 13.4,4.66 P1.3
$1N3054: length 19.3
  Bottom Layer w1.016: SW1.1 63.78,13.74 53.38,13.74 D2.1
$1N3055: length 3.1
  Bottom Layer w0.508: U2.4 32.75,21.88 33.91,20.72
$1N3056: length 3.2
  Bottom Layer w0.508: C3.1 32.75,27.72 U2.1
$1N3058: length 14
  Bottom Layer w0.508: L1.1 23.89,28 D1.1 27.06,26.95 U2.8 27.31,27.47 C3.2
$1N3060: length 2.7
  Bottom Layer w0.508: C7.1 23.73,18.71 R4.2
$1N3061: length 8.2
  Bottom Layer w0.508: C8.2 20.3,21.77 C7.2 26.62,24.66 U2.6
$1N3063: length 9.5
  Bottom Layer w0.508: 37.8,23.4 35.24,23.4 33.98,24.66 U2.3 ; 37.8,23.4 R1.1 ; 37.8,23.4 R2.2
$1N3066: length 5.9
  Bottom Layer w0.508: U2.5 28.9,21.81 R5.2 R3.1
$1N3070: length 4.6
  Bottom Layer w0.508: R8.2 37.62,28.35 LED1.2

## Copper pours and planes (outline as drawn; the poured copper is in the pictures)
GND on Top Layer: -0.19,45.36 70.42,45.36 70.42,-0.1 -0.19,-0.1
GND on Bottom Layer: -0.19,45.36 70.42,45.36 70.42,-0.1 -0.19,-0.1

Small or netless copper shapes (teardrops, artwork), in the pictures only: 17 on Top Layer, 85 on Bottom Layer

## Text on the board
Bottom Silkscreen Layer: vin | 5v
Top Silkscreen Layer: 5v | 3v3
